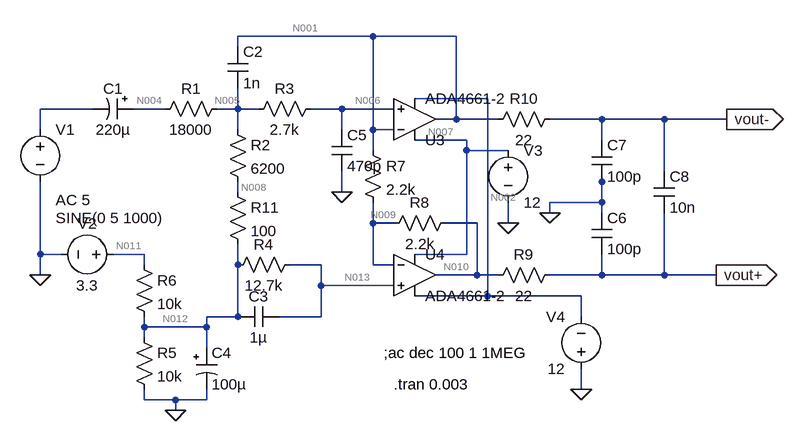
[diagram p0: schematic input differential circuit model.asc]
input differential circuit model.asc, the LTspice schematic file:
Version 4
SHEET 1 1768 680
WIRE 752 48 544 48
WIRE 880 48 752 48
WIRE 544 64 544 48
WIRE 928 144 816 144
WIRE 320 160 240 160
WIRE 432 160 384 160
WIRE 544 160 544 128
WIRE 544 160 512 160
WIRE 576 160 544 160
WIRE 704 160 656 160
WIRE 784 160 704 160
WIRE 880 176 880 48
WIRE 880 176 848 176
WIRE 944 176 880 176
WIRE 1104 176 1024 176
WIRE 1200 176 1104 176
WIRE 1296 176 1200 176
WIRE 240 192 240 160
WIRE 544 192 544 160
WIRE 704 192 704 160
WIRE 752 192 752 48
WIRE 784 192 752 192
WIRE 896 208 816 208
WIRE 1104 208 1104 176
WIRE 752 224 752 192
WIRE 896 224 896 208
WIRE 960 224 896 224
WIRE 1200 256 1200 176
WIRE 1104 272 1104 256
WIRE 544 288 544 272
WIRE 704 288 704 256
WIRE 1104 304 1104 272
WIRE 1104 304 1024 304
WIRE 1024 320 1024 304
WIRE 1104 320 1104 304
WIRE 752 336 752 304
WIRE 784 336 752 336
WIRE 912 336 864 336
WIRE 960 336 960 304
WIRE 240 384 240 272
WIRE 272 384 240 384
WIRE 400 384 352 384
WIRE 896 384 896 224
WIRE 896 384 816 384
WIRE 400 400 400 384
WIRE 544 400 544 368
WIRE 672 400 624 400
WIRE 752 400 752 336
WIRE 784 400 752 400
WIRE 240 416 240 384
WIRE 912 416 912 336
WIRE 912 416 848 416
WIRE 944 416 912 416
WIRE 1104 416 1104 384
WIRE 1104 416 1024 416
WIRE 1200 416 1200 320
WIRE 1200 416 1104 416
WIRE 1280 416 1200 416
WIRE 672 432 672 400
WIRE 784 432 672 432
WIRE 928 448 928 144
WIRE 928 448 816 448
WIRE 1072 448 928 448
WIRE 544 480 544 400
WIRE 544 480 496 480
WIRE 672 480 672 432
WIRE 672 480 608 480
WIRE 1072 480 1072 448
WIRE 400 496 400 480
WIRE 496 496 496 480
WIRE 496 496 400 496
WIRE 400 512 400 496
WIRE 496 528 496 496
WIRE 1072 592 1072 560
WIRE 400 608 400 592
WIRE 448 608 400 608
WIRE 496 608 496 592
WIRE 496 608 448 608
WIRE 448 624 448 608
FLAG 240 416 0
FLAG 448 624 0
FLAG 704 288 0
FLAG 1024 320 0
FLAG 1296 176 vout-
IOPIN 1296 176 Out
FLAG 1280 416 vout+
IOPIN 1280 416 Out
FLAG 1072 592 0
FLAG 960 336 0
SYMBOL voltage 240 176 R0
WINDOW 3 24 152 Left 2
WINDOW 123 24 124 Left 2
WINDOW 39 0 0 Left 0
SYMATTR Value SINE(0 5 1000)
SYMATTR Value2 AC 5
SYMATTR InstName V1
SYMBOL polcap 384 144 R90
WINDOW 0 0 32 VBottom 2
WINDOW 3 32 32 VTop 2
SYMATTR InstName C1
SYMATTR Value 220µ
SYMATTR Description Capacitor
SYMATTR Type cap
SYMATTR SpiceLine V=25 Irms=575m Rser=0.12 Lser=0 mfg="Panasonic" pn="ECA1EFQ221L" type="Al electrolytic"
SYMBOL res 528 144 R90
WINDOW 0 0 56 VBottom 2
WINDOW 3 32 56 VTop 2
SYMATTR InstName R1
SYMATTR Value 18000
SYMBOL res 528 176 R0
SYMATTR InstName R2
SYMATTR Value 6200
SYMBOL res 672 144 R90
WINDOW 0 0 56 VBottom 2
WINDOW 3 32 56 VTop 2
SYMATTR InstName R3
SYMATTR Value 2.7k
SYMBOL cap 528 64 R0
SYMATTR InstName C2
SYMATTR Value 1n
SYMBOL res 640 384 R90
WINDOW 0 0 56 VBottom 2
WINDOW 3 32 56 VTop 2
SYMATTR InstName R4
SYMATTR Value 12.7k
SYMBOL cap 608 464 R90
WINDOW 0 0 32 VBottom 2
WINDOW 3 32 32 VTop 2
SYMATTR InstName C3
SYMATTR Value 1µ
SYMBOL polcap 480 528 R0
SYMATTR InstName C4
SYMATTR Value 100µ
SYMATTR Description Capacitor
SYMATTR Type cap
SYMATTR SpiceLine V=10 Irms=3 Rser=0.025 Lser=0 mfg="KEMET" pn="T525D107M010ATE025" type="Tantalum"
SYMBOL res 384 496 R0
SYMATTR InstName R5
SYMATTR Value 10k
SYMBOL res 384 384 R0
SYMATTR InstName R6
SYMATTR Value 10k
SYMBOL voltage 368 384 R90
WINDOW 0 -32 56 VBottom 2
WINDOW 3 32 56 VTop 2
WINDOW 123 0 0 Left 0
WINDOW 39 0 0 Left 0
SYMATTR InstName V2
SYMATTR Value 3.3
SYMBOL cap 688 192 R0
SYMATTR InstName C5
SYMATTR Value 470p
SYMBOL res 736 208 R0
SYMATTR InstName R7
SYMATTR Value 2.2k
SYMBOL res 880 320 R90
WINDOW 0 0 56 VBottom 2
WINDOW 3 32 56 VTop 2
SYMATTR InstName R8
SYMATTR Value 2.2k
SYMBOL res 1040 400 R90
WINDOW 0 0 56 VBottom 2
WINDOW 3 32 56 VTop 2
SYMATTR InstName R9
SYMATTR Value 22
SYMBOL res 1040 160 R90
WINDOW 0 0 56 VBottom 2
WINDOW 3 32 56 VTop 2
SYMATTR InstName R10
SYMATTR Value 22
SYMBOL cap 1088 320 R0
SYMATTR InstName C6
SYMATTR Value 100p
SYMBOL cap 1088 208 R0
SYMATTR InstName C7
SYMATTR Value 100p
SYMBOL cap 1184 256 R0
SYMATTR InstName C8
SYMATTR Value 10n
SYMBOL voltage 960 208 R0
WINDOW 123 0 0 Left 0
WINDOW 39 0 0 Left 0
SYMATTR InstName V3
SYMATTR Value 12
SYMBOL voltage 1072 576 R180
WINDOW 0 24 96 Left 2
WINDOW 3 24 16 Left 2
WINDOW 123 0 0 Left 0
WINDOW 39 0 0 Left 0
SYMATTR InstName V4
SYMATTR Value 12
SYMBOL Opamps\\ADA4661-2 816 240 M180
SYMATTR InstName U3
SYMBOL Opamps\\ADA4661-2 816 352 R0
SYMATTR InstName U4
SYMBOL res 528 272 R0
SYMATTR InstName R11
SYMATTR Value 100
TEXT 768 536 Left 2 !;ac dec 100 1 1MEG
TEXT 784 584 Left 2 !.tran 0.003

The netlist it stands for:
* input differential circuit model.asc
V1 N003 0 SINE(0 5 1000) AC 5
C1 N004 N003 220µ V=25 Irms=575m Rser=0.12 Lser=0 mfg="Panasonic" pn="ECA1EFQ221L" type="Al electrolytic"
R1 N005 N004 18000
R2 N005 N008 6200
R3 N006 N005 2.7k
C2 N001 N005 1n
R4 N013 N012 12.7k
C3 N013 N012 1µ
C4 N012 0 100µ V=10 Irms=3 Rser=0.025 Lser=0 mfg="KEMET" pn="T525D107M010ATE025" type="Tantalum"
R5 N012 0 10k
R6 N011 N012 10k
V2 N011 0 3.3
C5 N006 0 470p
R7 N001 N009 2.2k
R8 N010 N009 2.2k
R9 vout+ N010 22
R10 vout- N001 22
C6 0 vout+ 100p
C7 vout- 0 100p
C8 vout- vout+ 10n
V3 N007 0 12
V4 0 N002 12
XU3 N006 N001 N007 N002 N001 ADA4661-2  ; pins In+ In- V+ V- OUT
XU4 N013 N009 N007 N002 N010 ADA4661-2  ; pins In+ In- V+ V- OUT
R11 N008 N012 100
;ac dec 100 1 1MEG
.tran 0.003
.lib ADI1.lib
.backanno
.end

* Results of the author's LTspice run, read from the files saved beside the schematic
* Operating Point, zero values left out:
*   V(n004) = 1.65 V
*   V(n005) = 1.65 V
*   V(n008) = 1.65 V
*   V(n006) = 1.65 V
*   V(n001) = 1.651 V
*   V(n013) = 1.65 V
*   V(n012) = 1.65 V
*   V(n011) = 3.3 V
*   V(n009) = 1.651 V
*   V(n010) = 1.651 V
*   V(vout+) = 1.651 V
*   V(vout-) = 1.651 V
*   V(n007) = 12 V
*   V(n002) = -12 V
*   I(R11) = -1.5 pA
*   I(R8) = -4.022 pA
*   I(R7) = 2.522 pA
*   I(R6) = 165 µA
*   I(R5) = 165 µA
*   I(R4) = -1.5 pA
*   I(R3) = -1.5 pA
*   I(R2) = -1.5 pA
*   I(V4) = -1.279 mA
*   I(V3) = -1.279 mA
*   I(V2) = -165 µA
*   Ix(u3:1) = 1.5 pA
*   Ix(u3:2) = -1.5 pA
*   Ix(u3:99) = 639.5 µA
*   Ix(u3:50) = -639.5 µA
*   Ix(u3:45) = -1.022 pA
*   Ix(u4:1) = 1.5 pA
*   Ix(u4:2) = -1.5 pA
*   Ix(u4:99) = 639.5 µA
*   Ix(u4:50) = -639.5 µA
*   Ix(u4:45) = 4.022 pA
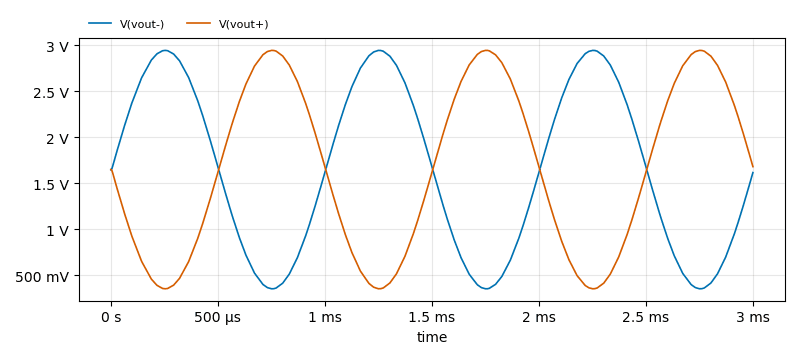
[diagram p1: Transient Analysis of input differential circuit model.asc, plotted from the saved traces]
* Transient Analysis, 1 run:
*   V(vout-): min 354.7 mV, max 2.947 V, average 1.651 V, rms 1.888 V, last 1.618 V
*   V(vout+): min 354.8 mV, max 2.947 V, average 1.651 V, rms 1.888 V, last 1.683 V